# Altium project LED_Morph.PrjPcb
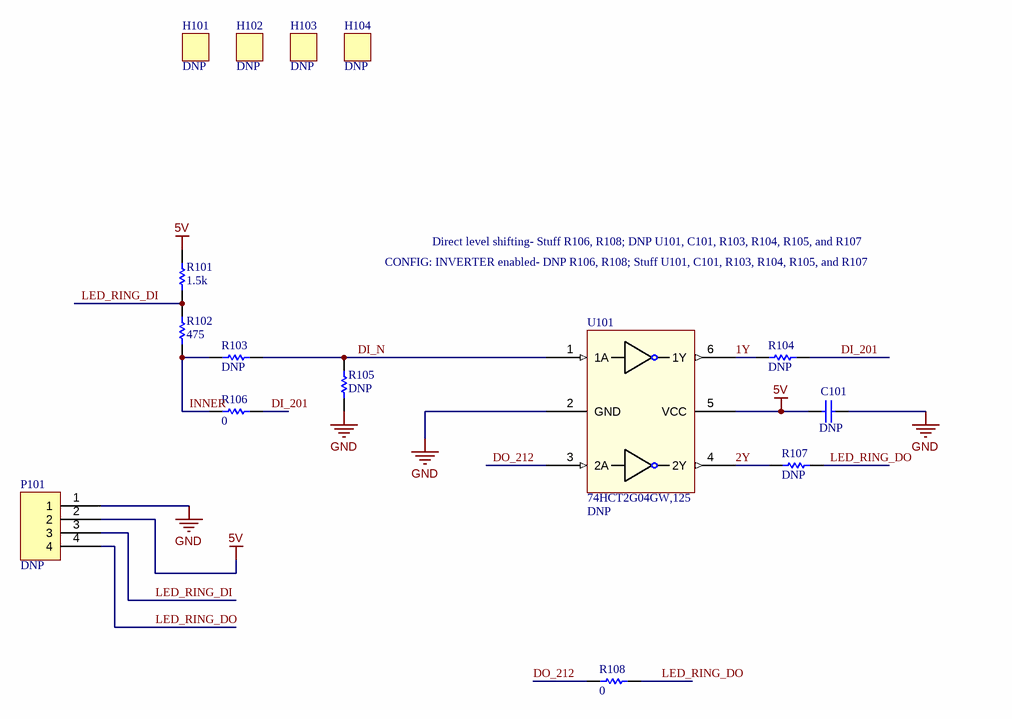
[diagram p0: Morpheus_LED1.SchDoc]
1 sheet, 15 parts. Net scope: global (net labels, ports and power ports of the same name join across sheets).
Board file: Morpheus_LED.PcbDoc

## Sheet Morpheus_LED1.SchDoc: Morpheus_LED
size Letter; DrawnBy: Ben Peng; Organization: Altium Limited; Address1: 1660 17th; Address2: San Francisco; Address3: CA; Address4: 94107; DocumentNumber: 6; Revision: DVT; SheetNumber: 1; SheetTotal: 2

### Parts
C101  DNP  [CAP0402_SENSE_DVT]
H101  DNP  [HOLE_ROUND_1.4mm]
H102  DNP  [HOLE_ROUND_1.4mm]
H103  DNP  [HOLE_ROUND_1.4mm]
H104  DNP  [HOLE_ROUND_1.4mm]
P101  DNP  [mate_for_molex_47420-0001]
R101  1.5k  [RES0402_SENSE_DVT]
R102  475  [RES0402_SENSE_DVT]
R103  DNP  [RES0402_SENSE_DVT]
R104  DNP  [RES0402_SENSE_DVT]
R105  DNP  [RES0402_SENSE_DVT]
R106  0  [RES0402_SENSE_DVT]
R107  DNP  [RES0402_SENSE_DVT]
R108  0  [RES0402_SENSE_DVT]
U101  DNP  PN: 74HCT2G04GW,125  [SOT65P210X110-6N]

### Nets
5V: C101.1 P101.2 R101.2 U101.5(VCC)
GND: C101.2 P101.1 R105.1 U101.2(GND)
1Y: R104.1 U101.6(1Y)
2Y: R107.1 U101.4(2Y)
DI_201: R104.2 R106.2
DI_N: R103.2 R105.2 U101.1(1A)
DO_212: R108.1 U101.3(2A)
INNER: R102.1 R103.1 R106.1
LED_RING_DI: P101.3 R101.1 R102.2
LED_RING_DO: P101.4 R107.2 R108.2

### Notes on the sheet
- Direct level shifting- Stuff R106, R108; DNP U101, C101, R103, R104, R105, and R107
- CONFIG: INVERTER enabled- DNP R106, R108; Stuff U101, C101, R103, R104, R105, and R107
- TITLE
- DATE
- DRAWN BY
- REV
- SHEET
- OF

### Library data of the parts
C101 = C_0.1u_10_50_X7R_0402: Chip capacitor; Value: 0.1u; Vendor: Taiyo Yuden; PN: UMK105B7104KV-FR; Tolerance: 10%; Voltage: 50V; Temp: X7R; Size: 0402
H101-H104 = Hole: general purpose hole
P101 = mate_for_molex_47420-0001: Molex 4-pin spring connector 1.8 mm working height
R101 = R_1.5k_5_0.1_0402: Chip Resistor; Vendor: Panasonic; Tolerance: 5 %; Power: 0.1 W; PN: ERJ-2GEJ152X; Model: *; Value: 1.5k; Size: 0402
R102 = R_475_1_0.1_0402: Chip Resistor; Vendor: Panasonic; Tolerance: 1 %; Power: 0.1 W; PN: ERJ-2RKF4750X; Model: *; Value: 475; Size: 0402
R103 = R_0_jumper_0.1_0402: Chip Resistor; Value: 0; Vendor: Panasonic; Tolerance: Jumper; Power: 0.1 W; PN: ERJ-2GE0R00X; Model: *; Size: 0402
R104 R107 = R_100_1_0.1_0402: Chip Resistor; Value: 100; Vendor: Panasonic; Tolerance: 1 %; Power: 0.1 W; PN: ERJ-2RKF1000X; Model: *; Size: 0402
R105 = R_1.5k_5_0.1_0402: Chip Resistor; Value: 1.5k; Vendor: Panasonic; Tolerance: 5 %; Power: 0.1 W; PN: ERJ-2GEJ152X; Model: *; Size: 0402
R106 R108 = R_0_jumper_0.1_0402: Chip Resistor; Vendor: Panasonic; Tolerance: Jumper; Power: 0.1 W; PN: ERJ-2GE0R00X; Model: *; Value: 0; Size: 0402
U101 = 74HCT2G04: Dual inverter The 74HC2G04; 74HCT2G04 is a high-speed Si-gate CMOS device.; Vendor: NXP Semiconductors